# EAGLE design motor_shield (EAGLE 7.7.0)
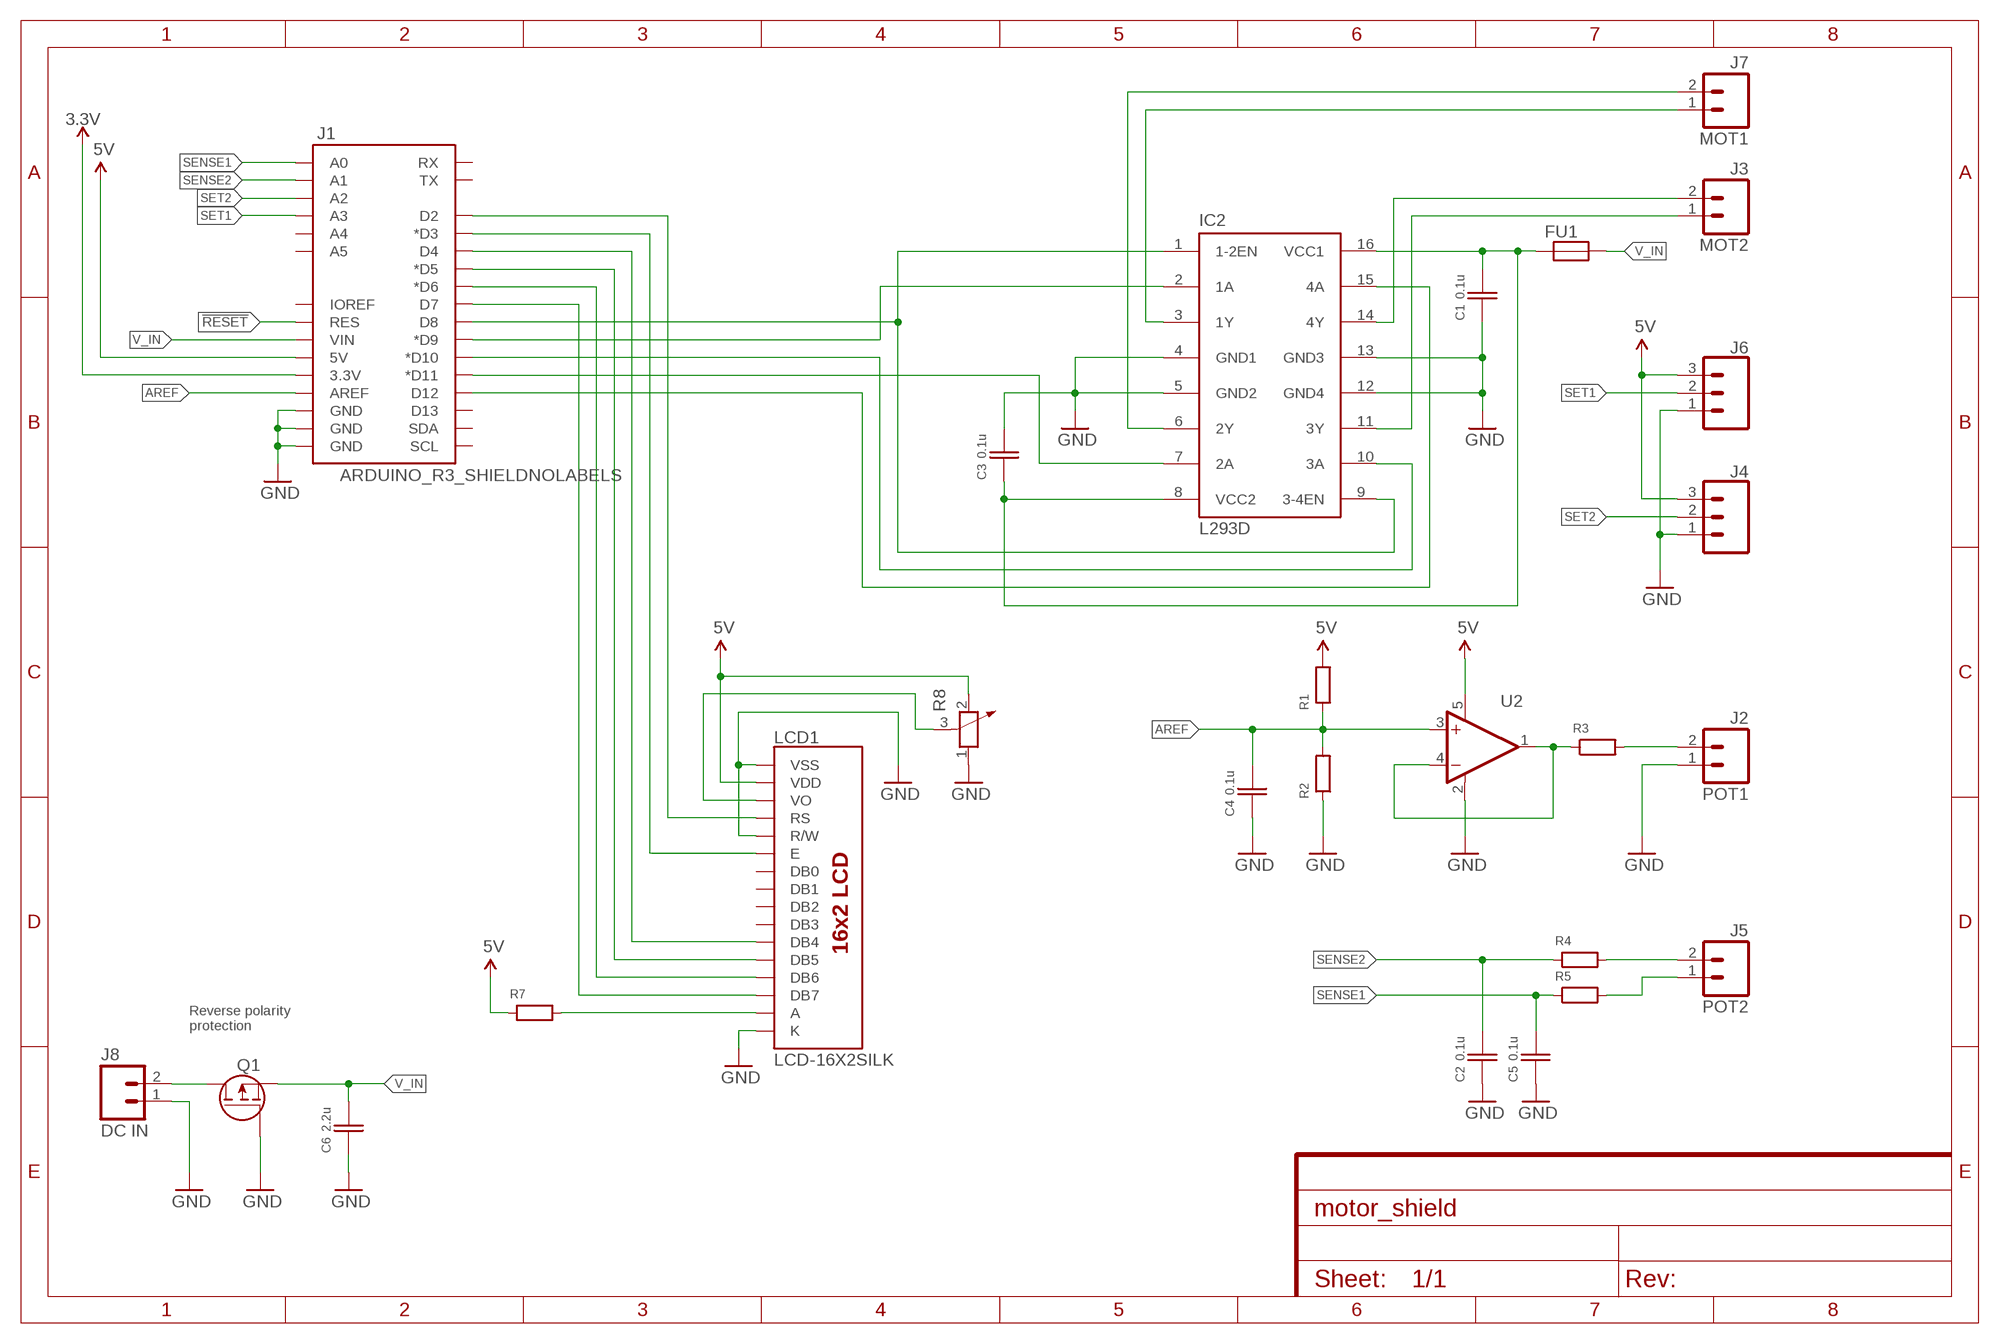
[diagram p0: schematic, sheet 1]

## Parts
C1  0.1u  CAPACITOR_NPOL-0805  [C805]
C2  0.1u  CAPACITOR_NPOL-0603  [C603]
C3  0.1u  CAPACITOR_NPOL-0805  [C805]
C4  0.1u  CAPACITOR_NPOL-0603  [C603]
C5  0.1u  CAPACITOR_NPOL-0603  [C603]
C6  2.2u  CAPACITOR_NPOL-1206  [C1206]
FU1  PTC_FUSE  [C1812K]
IC2  L293D  [DIL16]
J1  ARDUINO_R3_SHIELDNOLABELS  [UNO_R3_SHIELD_NOLABELS]
J2  POT1  M023.5MM  [SCREWTERMINAL-3.5MM-2]
J3  MOT2  M023.5MM  [SCREWTERMINAL-3.5MM-2]
J4  CONN_03SCREW  [SCREWTERMINAL-3.5MM-3]
J5  POT2  M023.5MM  [SCREWTERMINAL-3.5MM-2]
J6  CONN_03SCREW  [SCREWTERMINAL-3.5MM-3]
J7  MOT1  M023.5MM  [SCREWTERMINAL-3.5MM-2]
J8  DC IN  M023.5MM  [SCREWTERMINAL-3.5MM-2]
LCD1  LCD-16X2SILK  [LCD-16X2]
Q1  MOSFET-P-SOT23-3  [SOT23-3]
R1  RESISTOR-0603  [R0603]
R2  RESISTOR-0603  [R0603]
R3  RESISTOR-0603  [R0603]
R4  RESISTOR-0603  [R0603]
R5  RESISTOR-0603  [R0603]
R7  RESISTOR-0603  [R0603]
R8  POTENTIOMETER_PT-10S  [PT-10S]
U2  OPAMP-1CH-SOT23-5  [SOT23-5]

## Nets
3.3V: J1.3.3V
5V: J1.5V J4.3 J6.3 LCD1.2(VDD) R1.2 R7.1 R8.2 U2.5(V+)
!RESET: J1.RES
AREF: C4.2 J1.AREF R1.1 R2.2 U2.3(+IN)
GND: C1.1 C2.1 C3.2 C4.1 C5.1 C6.1 IC2.4(GND1) IC2.5(GND2) IC2.12(GND4) IC2.13(GND3) J1.GND@0(GND) J1.GND@1(GND) J1.GND@2(GND) J2.1 J4.1 J6.1 J8.1 LCD1.1(VSS) LCD1.5(R/W) LCD1.16(K) Q1.1(G) R2.1 R8.1 U2.2(V-)
N$1: IC2.1(1-2EN) IC2.9(3-4EN) J1.D8
N$2: R3.1 U2.1(OUT) U2.4(-IN)
N$4: LCD1.15(A) R7.2
N$5: J5.2 R4.2
N$6: IC2.3(1Y) J7.1
N$7: IC2.6(2Y) J7.2
N$8: IC2.2(1A) J1.D9(*D9)
N$9: IC2.7(2A) J1.D11(*D11)
N$10: IC2.11(3Y) J3.1
N$11: IC2.14(4Y) J3.2
N$12: IC2.15(4A) J1.D12
N$13: IC2.10(3A) J1.D10(*D10)
N$14: J2.2 R3.2
N$15: J5.1 R5.2
N$16: J1.D4 LCD1.11(DB4)
N$17: J1.D5(*D5) LCD1.12(DB5)
N$18: J1.D6(*D6) LCD1.13(DB6)
N$19: J1.D7 LCD1.14(DB7)
N$20: J1.D3(*D3) LCD1.6(E)
N$21: J1.D2 LCD1.4(RS)
N$22: C1.2 C3.1 FU1.1 IC2.8(VCC2) IC2.16(VCC1)
N$23: LCD1.3(VO) R8.3
N$31: J8.2 Q1.3(D)
SENSE1: C5.2 J1.A0 R5.1
SENSE2: C2.2 J1.A1 R4.1
SET1: J1.A3 J6.2
SET2: J1.A2 J4.2
V_IN: C6.2 FU1.2 J1.VIN Q1.2(S)
Unconnected: J1.A4 J1.A5 J1.D13 J1.IOREF J1.RX J1.SCL J1.SDA J1.TX LCD1.7(DB0) LCD1.8(DB1) LCD1.9(DB2) LCD1.10(DB3)

## Notes on the sheet
- Reverse polarity
  protection

## Library data of the parts
C1-C6 = kg-generic:CAPACITOR_NPOL: Non-Polarized capacitor in various packages
FU1 = kg-generic:PTC_FUSE
IC2 = st-microelectronics:L293D: PUSH-PULL 4 CHANNEL DRIVER; MPN: L293D; OC_FARNELL: 9589619; OC_NEWARK: 56P8249
J1 = SparkFun-Boards:ARDUINO_R3_SHIELD: Shield form compatible with the Arduino Uno R3.
J2 J3 J5 J7 J8 = SparkFun-Connectors:M02: Standard 2-pin 0.1" header. Use with - straight break away headers ( PRT-00116) - right angle break away headers (PRT-00553) - swiss pins (PRT-00743) - machine pins (PRT-00117) - female headers (PRT-00115) Molex polarized connector foot print use with: PRT-08233 with associated crimp pins and housings. 2.54_SCREWTERM for use with PRT-10571. 3.5mm Screw Terminal footprints for PRT-08084 5mm Screw Terminal footprints for use with PRT-08432; PROD_ID: CONN-08399
J4 J6 = SparkFun-Connectors:CONN_03: Multi connection point. Often used as Generic Header-pin footprint for 0.1 inch spaced/style header connections On any of the 0.1 inch spaced packages, you can populate with these: Break Away Headers - Straight <https://www.sparkfun.com/products/116> (PRT-00116) Break Away Male Headers - Right Angle <https://www.sparkfun.com/products/553> (PRT-00553) Female Headers <https://www.sparkfun.com/products/115> (PRT-00115) Break Away Headers - Machine Pin <https://www.sparkfun.com/products/117> (PRT-00117) Break Away Female Headers - Swiss Machine Pin <https://www.sparkfun.com/products/743> (PRT-00743) Stackable Header - 3 Pin (Female, 0.1") <https://www.sparkfun.com/products/13875> (PRT-13875) For SCREWTERMINALS and SPRING TERMINALS visit here: Screw Terimnals on SparkFun.com <https://www.sparkfun.com/search/results?term=Screw+Terminals> (5mm/3.5mm/2.54mm spacing) This device is also useful as a general connection point to wire up your design to another part of your project. Our various solder wires solder well into these plated through hole pads. Hook-Up Wire - Assortment (Stranded, 22 AWG) <https://www.sparkfun.com/products/11375> (PRT-11375) Hook-Up Wire - Assortment (Solid Core, 22 AWG) <https://www.sparkfun.com/products/11367> (PRT-11367) View the entire wire category on our website here <https://www.sparkfun.com/categories/141> Special notes: Molex polarized connector foot print use with SKU : PRT-08232 with associated crimp pins and housings.; PROD_ID: CONN-08288; SF_ID: PRT-08235
LCD1 = SparkFun-Displays:LCD-16X2: Standard text-only 16x2 parallel input LCD Basic 16 character by 2 line display. Typically utilizes the extremely common HD44780 parallel interface chipset SparkFun Products: Basic 16x2 Green <https://www.sparkfun.com/products/255> Basic 8x2 Green <https://www.sparkfun.com/products/11122>; SF_ID: LCD-00255
Q1 = kg-generic:MOSFET-P: Generic P-MOSFET IRF7406 SO8 30V 5.8A 45mOhm IRLML6401 SOT23-3 12V 4.3A 50mOhm IRLML6402 SOT23-3 20V 3.7A 65mOhm
R1-R5 R7 = kg-generic:RESISTOR: Generic resistor
R8 = rcl:POTENTIOMETER_: Potentiometer
U2 = kg-generic:OPAMP-1CH: 1 Channel OpAmp

## Board
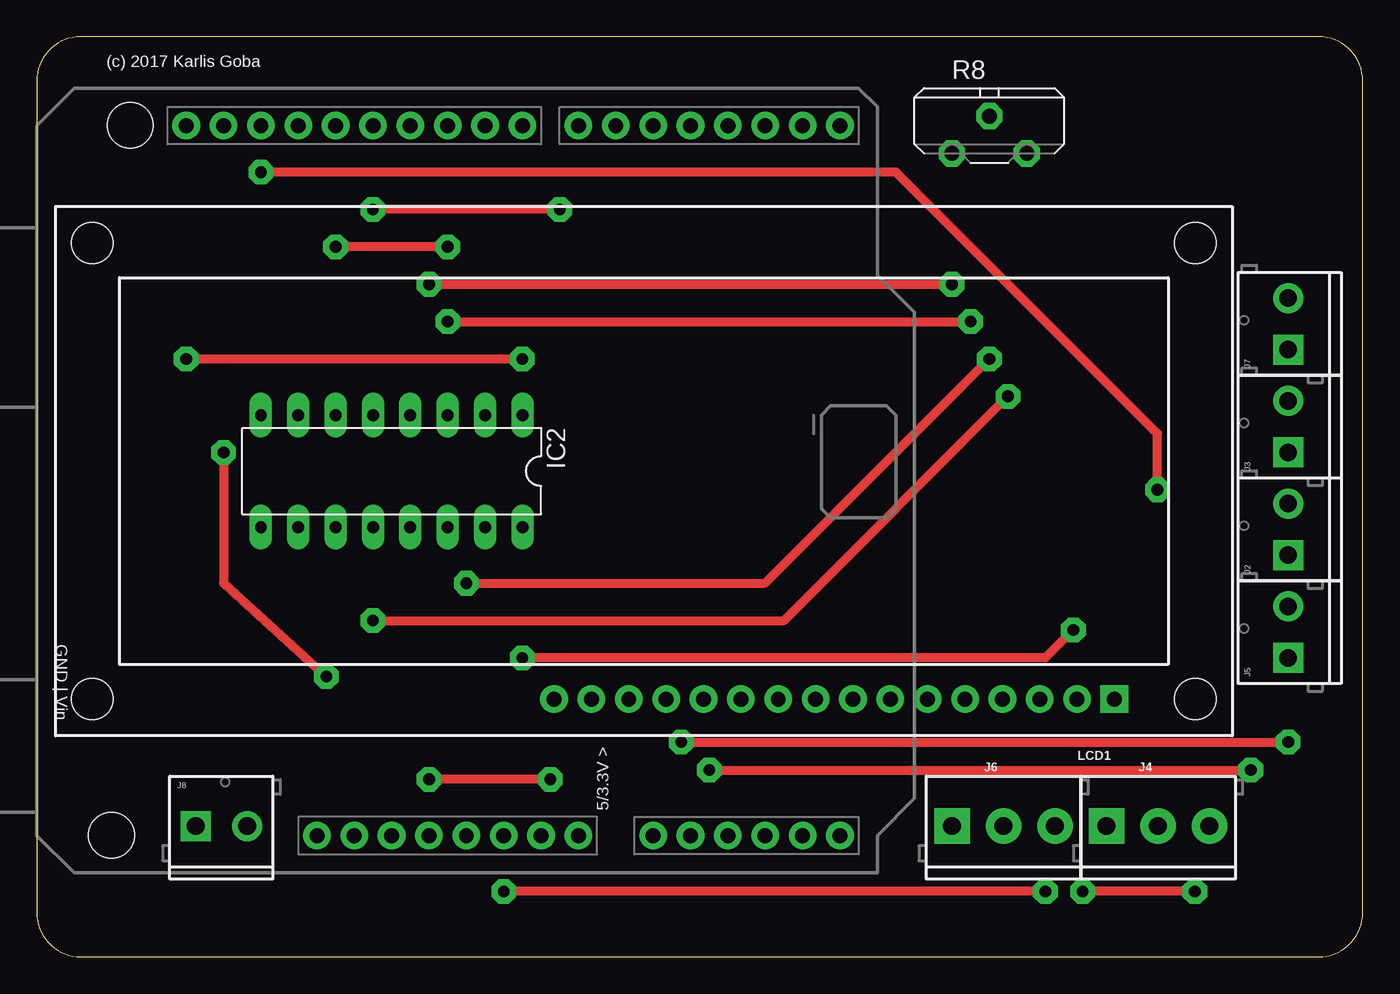
[diagram p1: board, top side]
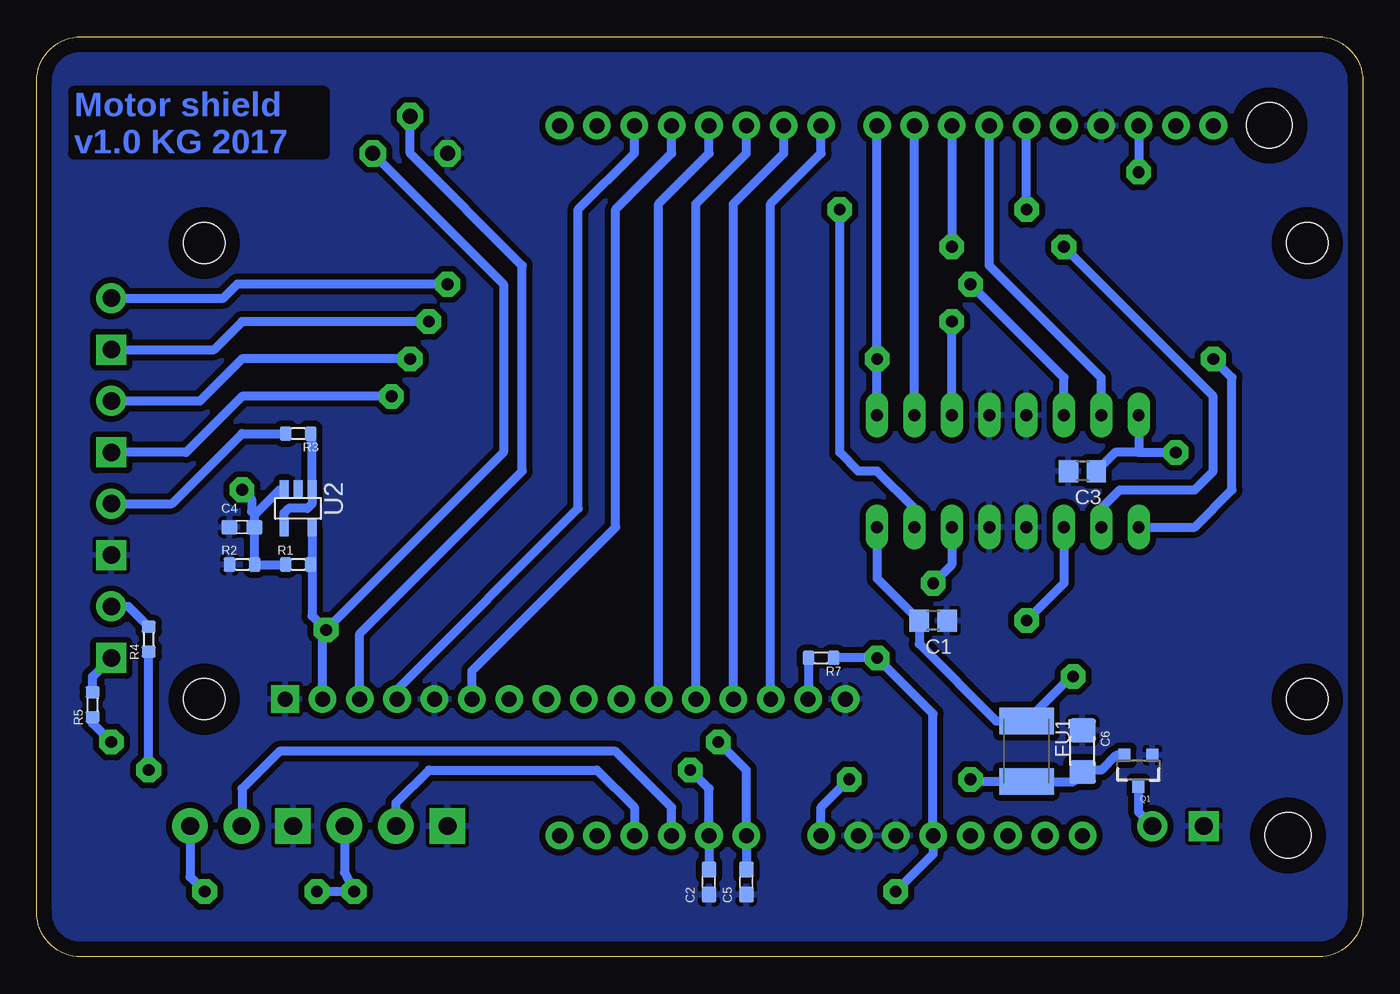
[diagram p2: board, bottom side, seen from below]

Size 90.16 x 62.54 mm. Coordinates in mm from the lower left corner, seen from the top.
Outline: 0,59.54 0,3 arc90 3,0 87.16,0 arc90 90.16,3 90.16,59.54 arc90 87.16,62.54 3,62.54 arc90 0,59.54
Copper layers (1*16): Top 0.035mm / dielectric 1.5mm / Bottom 0.035mm
Design rules "default *": minimum track width 10mil, minimum drill 24mil, track to track 8mil, track to pad 8mil, pad to pad 8mil, via to via 8mil, smd to smd 8mil, copper to edge 40mil, drill to drill 8mil, minimum pad ring 14mil, minimum via ring 8mil, stop-mask expansion 4mil, vias tented up to drill 0mil, thermal gap 10mil
Holes 3.1 mm at 5.08,8.25 6.35,56.52

### Footprints (pad centres in the part's own frame; a part is rotated, then mirrored left to right if it is on the bottom)
C805 = smd 1.3 x 1.5: 1 -0.95,0; 2 0.95,0
C603 = smd 1.1 x 1: 1 -0.85,0; 2 0.85,0
C1206 = smd 1.6 x 1.803: 1 -1.422,0; 2 1.422,0
C1812K = smd 1.8 x 3.7: 1 -2.05,0; 2 2.05,0
DIL16 = drill 0.813 long: 1 -8.89,-3.81; 2 -6.35,-3.81; 3 -3.81,-3.81; 4 -1.27,-3.81; 5 1.27,-3.81; 6 3.81,-3.81; 7 6.35,-3.81; 8 8.89,-3.81; 9 8.89,3.81; 10 6.35,3.81; 11 3.81,3.81; 12 1.27,3.81; 13 -1.27,3.81; 14 -3.81,3.81; 15 -6.35,3.81; 16 -8.89,3.81
UNO_R3_SHIELD_NOLABELS = drill 1.016 pad 1.88: 3.3V 50.8,26.67; 5V 50.8,29.21; A0 50.8,41.91; A1 50.8,44.45; A2 50.8,46.99; A3 50.8,49.53; A4 50.8,52.07; A5 50.8,54.61; AREF 2.54,15.24; D2 2.54,49.53; D3 2.54,46.99; D4 2.54,44.45; D5 2.54,41.91; D6 2.54,39.37; D7 2.54,36.83; D8 2.54,33.02; D9 2.54,30.48; D10 2.54,27.94; D11 2.54,25.4; D12 2.54,22.86; D13 2.54,20.32; GND@0 50.8,31.75; GND@1 50.8,34.29; GND@2 2.54,17.78; IOREF 50.8,21.59; NC 50.8,19.05; RES 50.8,24.13; RX 2.54,54.61; SCL 2.54,10.16; SDA 2.54,12.7; TX 2.54,52.07; VIN 50.8,36.83
SCREWTERMINAL-3.5MM-2 = drill 1.2 pad 2.032 square: 1 0,0 | drill 1.2 pad 2.032: 2 3.5,0
SCREWTERMINAL-3.5MM-3 = drill 1.2 pad 2.413 square: 1 0,0 | drill 1.2 pad 2.413: 2 3.5,0; 3 7,0
LCD-16X2 = drill 1.016 pad 1.88 square: 1 -32,15.5 | drill 1.016 pad 1.88: 2 -29.46,15.5; 3 -26.92,15.5; 4 -24.38,15.5; 5 -21.84,15.5; 6 -19.3,15.5; 7 -16.76,15.5; 8 -14.22,15.5; 9 -11.68,15.5; 10 -9.14,15.5; 11 -6.6,15.5; 12 -4.06,15.5; 13 -1.52,15.5; 14 1.02,15.5; 15 3.56,15.5; 16 6.1,15.5 | hole 2.8: -37.5,15.5; -37.5,-15.5; 37.5,15.5; 37.5,-15.5
SOT23-3 = smd 0.8 x 0.9: 1 -0.95,-1; 2 0.95,-1; 3 0,1.1
R0603 = smd 0.8 x 0.95: 1 -0.85,0; 2 0.85,0
PT-10S = drill 1.016 pad 1.778 octagon: 1 -2.54,-1.27; 2 2.54,-1.27; 3 0,1.27
SOT23-5 = smd 0.6 x 1.2: 1 -0.95,-1.306; 2 0,-1.306; 3 0.95,-1.306; 4 0.95,1.306; 5 -0.95,1.306

### Placement (x,y rotation side)
C1  29.21,22.86 180 bottom
C2  44.45,5.08 90 bottom
C3  19.05,33.02 180 bottom
C4  76.2,29.21 0 bottom
C5  41.91,5.08 90 bottom
C6  19.05,13.98 270 bottom
FU1  22.86,13.97 270 bottom
IC2  24.13,33.02 180 top
J1  0,59.05 270 top
J2  85.09,27.3 90 top
J3  85.09,34.29 90 top
J4  72.73,8.89 0 top
J5  85.09,20.32 90 top
J6  62.23,8.89 0 top
J7  85.09,41.27 90 top
J8  10.8,8.89 0 top
LCD1  41.27,33.02 180 top
Q1  15.25,12.7 180 bottom
R1  72.39,26.67 0 bottom
R2  76.2,26.67 0 bottom
R3  72.39,35.56 180 bottom
R4  82.55,21.59 90 bottom
R5  86.36,17.14 90 bottom
R7  36.83,20.32 180 bottom
R8  64.77,55.88 0 top
U2  72.39,30.48 180 bottom

### Tracks (layer width: path | path; a pad name or v marks a point on that pad's centre or on a via)
5V  (via drill 0.8 pad 1.68)
  Top 0.61: v70.48,22.22 68.58,20.32 v33.02,20.32 | v68.58,4.45 v31.75,4.45 | v78.74,4.45 v71.12,4.45
  Bottom 0.61: U2.5 71.44,26.77 | 71.44,26.77 R1.2 | R7.1 v33.02,20.32 29.21,16.51 J1.5V 29.21,6.99 v31.75,4.45 | v70.48,22.22 58.42,34.29 58.42,45.72 R8.2 | 71.44,26.77 71.44,23.18 v70.48,22.22 | LCD1.2 70.73,21.97 v70.48,22.22 | J6.3 69.23,5.73 v68.58,4.45 v71.12,4.45 | J4.3 79.73,5.44 v78.74,4.45
AREF  (via drill 0.8 pad 1.68)
  Top 0.61: v76.2,31.75 76.2,35.56 58.42,53.34 v15.24,53.34
  Bottom 0.61: J1.AREF v15.24,53.34 | R1.1 R2.2 C4.2 75.35,30.06 | 75.35,30.06 73.66,31.75 73.38,31.75 U2.3 | v76.2,31.75 75.56,31.11 75.56,30.27 75.35,30.06
GND
  pour Bottom (isolate 0.406): 92.71,65.84 92.71,-3.17 -2.54,-3.17 -2.54,65.84
N$1  (via drill 0.8 pad 1.68)
  Top 0.61: v10.16,40.64 v33.02,40.64
  Bottom 0.61: IC2.1 v33.02,40.64 J1.D8 | IC2.9 11.43,29.21 8.89,31.75 8.89,39.37 v10.16,40.64
N$2
  Bottom 0.61: U2.4 73.34,30.16 73.03,30.48 71.75,30.48 71.44,30.79 U2.1 71.44,35.46 R3.1
N$4
  Bottom 0.61: R7.2 37.68,17.55 LCD1.15
N$5
  Bottom 0.61: J5.2 83.93,23.82 R4.2
N$6  (via drill 0.8 pad 1.68)
  Top 0.61: v27.94,43.18 v63.5,43.18
  Bottom 0.61: IC2.3 v27.94,43.18 | v63.5,43.18 76.2,43.18 78.11,41.27 J7.1
N$7  (via drill 0.8 pad 1.68)
  Top 0.61: v26.67,45.72 v62.23,45.72
  Bottom 0.61: IC2.6 20.32,39.37 v26.67,45.72 | v62.23,45.72 76.53,45.72 77.47,44.77 J7.2
N$8
  Bottom 0.61: IC2.2 J1.D9
N$9
  Bottom 0.61: IC2.7 17.78,39.37 25.4,46.99 J1.D11
N$10  (via drill 0.8 pad 1.68)
  Top 0.61: v22.86,22.86 50.8,22.86 v66.04,38.1
  Bottom 0.61: IC2.11 20.32,25.4 v22.86,22.86 | v66.04,38.1 76.2,38.1 80.01,34.29 J3.1
N$11  (via drill 0.8 pad 1.68)
  Top 0.61: v29.21,25.4 49.53,25.4 v64.77,40.64
  Bottom 0.61: IC2.14 27.94,26.67 v29.21,25.4 | v64.77,40.64 76.2,40.64 79.05,37.79 J3.2
N$12  (via drill 0.8 pad 1.68)
  Top 0.61: v35.56,50.8 v22.86,50.8
  Bottom 0.61: v22.86,50.8 J1.D12 | IC2.15 30.48,30.48 33.02,33.02 34.29,33.02 35.56,34.29 v35.56,50.8
N$13  (via drill 0.8 pad 1.68)
  Top 0.61: v27.94,48.26 v20.32,48.26
  Bottom 0.61: J1.D10 v27.94,48.26 | IC2.10 17.78,30.48 16.51,31.75 11.43,31.75 10.16,33.02 10.16,38.1 v20.32,48.26
N$14
  Bottom 0.61: J2.2 80.95,30.8 76.2,35.56 R3.2
N$15
  Bottom 0.61: R5.2 86.36,19.05 J5.1
N$16
  Bottom 0.61: LCD1.11 47.88,51.19 44.45,54.61 J1.D4
N$17
  Bottom 0.61: LCD1.12 45.34,51.19 41.91,54.61 J1.D5
N$18
  Bottom 0.61: LCD1.13 42.8,51.19 39.37,54.61 J1.D6
N$19
  Bottom 0.61: LCD1.14 40.26,51.19 36.83,54.61 J1.D7
N$20
  Bottom 0.61: LCD1.6 60.58,19.43 50.8,29.21 50.8,50.8 46.99,54.61 J1.D3
N$21
  Bottom 0.61: LCD1.4 65.66,18.16 53.34,30.48 53.34,50.8 49.53,54.61 J1.D2
N$22  (via drill 0.8 pad 1.68)
  Top 0.61: v12.7,34.29 12.7,25.4 v19.68,19.05
  Bottom 0.61: IC2.16 33.02,25.72 C1.2 30.16,21.27 24.91,16.02 FU1.1 19.83,19.05 v19.68,19.05 | IC2.8 15.24,34.29 | 15.24,34.29 v12.7,34.29 | 15.24,34.29 16.83,34.29 C3.1
N$23
  Bottom 0.61: LCD1.3 68.19,21.97 57.15,33.02 57.15,46.99 64.77,54.61 R8.3
N$31
  Bottom 0.61: Q1.3 15.25,9.85 J8.2
SENSE1  (via drill 0.8 pad 1.68)
  Top 0.61: v43.81,14.61 v85.09,14.61
  Bottom 0.61: v43.81,14.61 41.91,12.7 J1.A0 C5.2 | R5.1 86.36,15.88 v85.09,14.61
SENSE2  (via drill 0.8 pad 1.68)
  Top 0.61: v45.72,12.7 v82.55,12.7
  Bottom 0.61: v45.72,12.7 44.45,11.43 J1.A1 C2.2 | v82.55,12.7 R4.1
SET1
  Bottom 0.61: J6.2 65.73,10.47 63.5,12.7 52.07,12.7 49.53,10.16 J1.A3
SET2
  Bottom 0.61: J1.A2 46.99,10.16 50.8,13.97 73.66,13.97 76.2,11.43 76.2,8.92 J4.2
V_IN  (via drill 0.8 pad 1.68)
  Top 0.61: v34.92,12.07 v26.67,12.07
  Bottom 0.61: J1.VIN 36.83,10.16 v34.92,12.07 | Q1.2 16.78,13.7 17.78,12.7 18.91,12.7 C6.2 19.69,11.92 FU1.2 25.89,11.92 v26.67,12.07

### Text on the board
Bottom: Motor shield / v1.0 KG 2017
tPlace: (c) 2017 Karlis Goba | v1.0 | SPDT Relay Shield | GND | Vin | 5/3.3V >